# EAGLE design Placa frizzy (EAGLE 7.7.0)

## Sheet 1 of 4
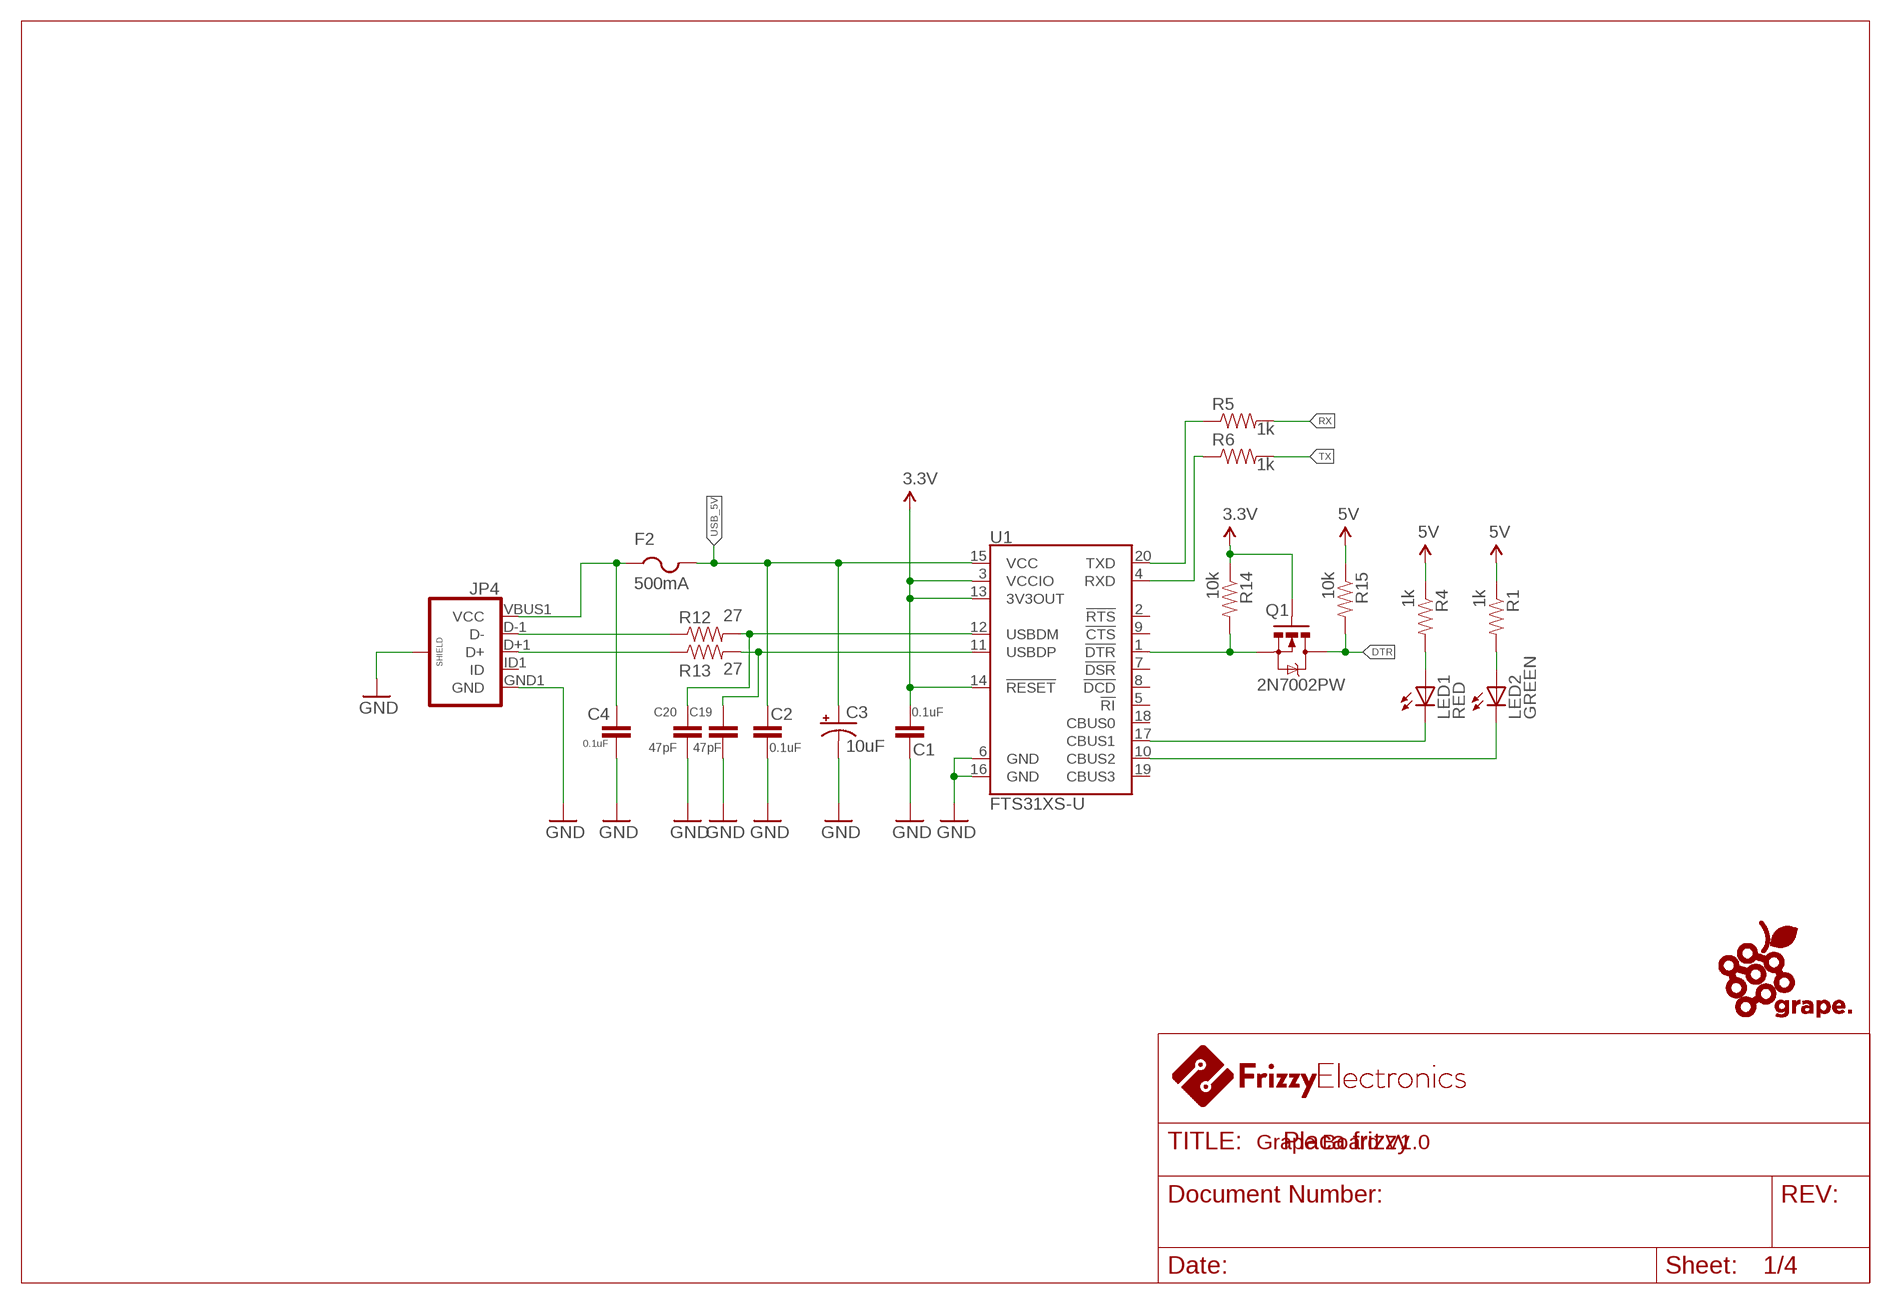
[diagram p0: schematic, sheet 1]

### Parts
C1  0.1uF  CAP0805  [0805]
C2  0.1uF  CAP0805  [0805]
C3  10uF  10UF-16V-10%(TANT)  [EIA3216]
C4  0.1uF  CAP0805  [0805]
C19  47pF  CAP0805  [0805]
C20  47pF  CAP0805  [0805]
F2  500mA  PTCFUSE-1812  [1812]
JP4  USB_MICROB_PLUGCONN-11752  [USB-B-MICRO-SMD_V03]
LED1  RED  LEDCHIP-LED0805  [CHIP-LED0805]
LED2  GREEN  LEDCHIP-LED0805  [CHIP-LED0805]
Q1  2N7002PW  MOSFET-NCHANNEL2N7002PW  [SOT323]
R1  1k  RESISTOR0805-RES  [0805]
R4  1k  RESISTOR0805-RES  [0805]
R5  1k  RESISTOR0805-RES  [0805]
R6  1k  RESISTOR0805-RES  [0805]
R12  27  RESISTOR0805-RES  [0805]
R13  27  RESISTOR0805-RES  [0805]
R14  10k  RESISTOR0805-RES  [0805]
R15  10k  RESISTOR0805-RES  [0805]
U1  FTS31XS-U  FT231XS  [SSOP20_L]

### Nets
3.3V: C1.2 Q1.1(G) R14.1 U1.3(VCCIO) U1.13(3V3OUT) U1.14(!RESET) ; also sheet 2,3
5V: R1.1 R4.1 R15.1 ; also sheet 2,3,4
DTR: Q1.3(D) R15.2 ; also sheet 2
GND: C1.1 C2.1 C3.C(-) C4.2 C19.1 C20.1 JP4.GND1(GND) JP4.SHIELD1(SHIELD) JP4.SHIELD2(SHIELD) JP4.SHIELD3(SHIELD) U1.6(GND) U1.16(GND) ; also sheet 2,3,4
N$2: LED1.C U1.17(CBUS1)
N$4: LED2.C U1.10(CBUS2)
N$5: LED1.A R4.2
N$6: LED2.A R1.2
N$8: R5.1 U1.20(TXD)
N$9: R6.1 U1.4(RXD)
N$13: C20.2 R12.2 U1.12(USBDM)
N$14: Q1.2(S) R14.2 U1.1(!DTR)
N$15: C19.2 R13.2 U1.11(USBDP)
N$24: JP4.D-1(D-) R12.1
N$28: JP4.D+1(D+) R13.1
N$29: C4.1 F2.1 JP4.VBUS1(VCC)
RX: R5.2 ; also sheet 2,4
TX: R6.2 ; also sheet 2,4
USB_5V: C2.2 C3.A(+) F2.2 U1.15(VCC) ; also sheet 3
Unconnected: JP4.ID1(ID) U1.2(!RTS) U1.5(!RI) U1.7(!DSR) U1.8(!DCD) U1.9(!CTS) U1.18(CBUS0) U1.19(CBUS3)

### Notes on the sheet
- Grape Board V1.0

## Sheet 2 of 4
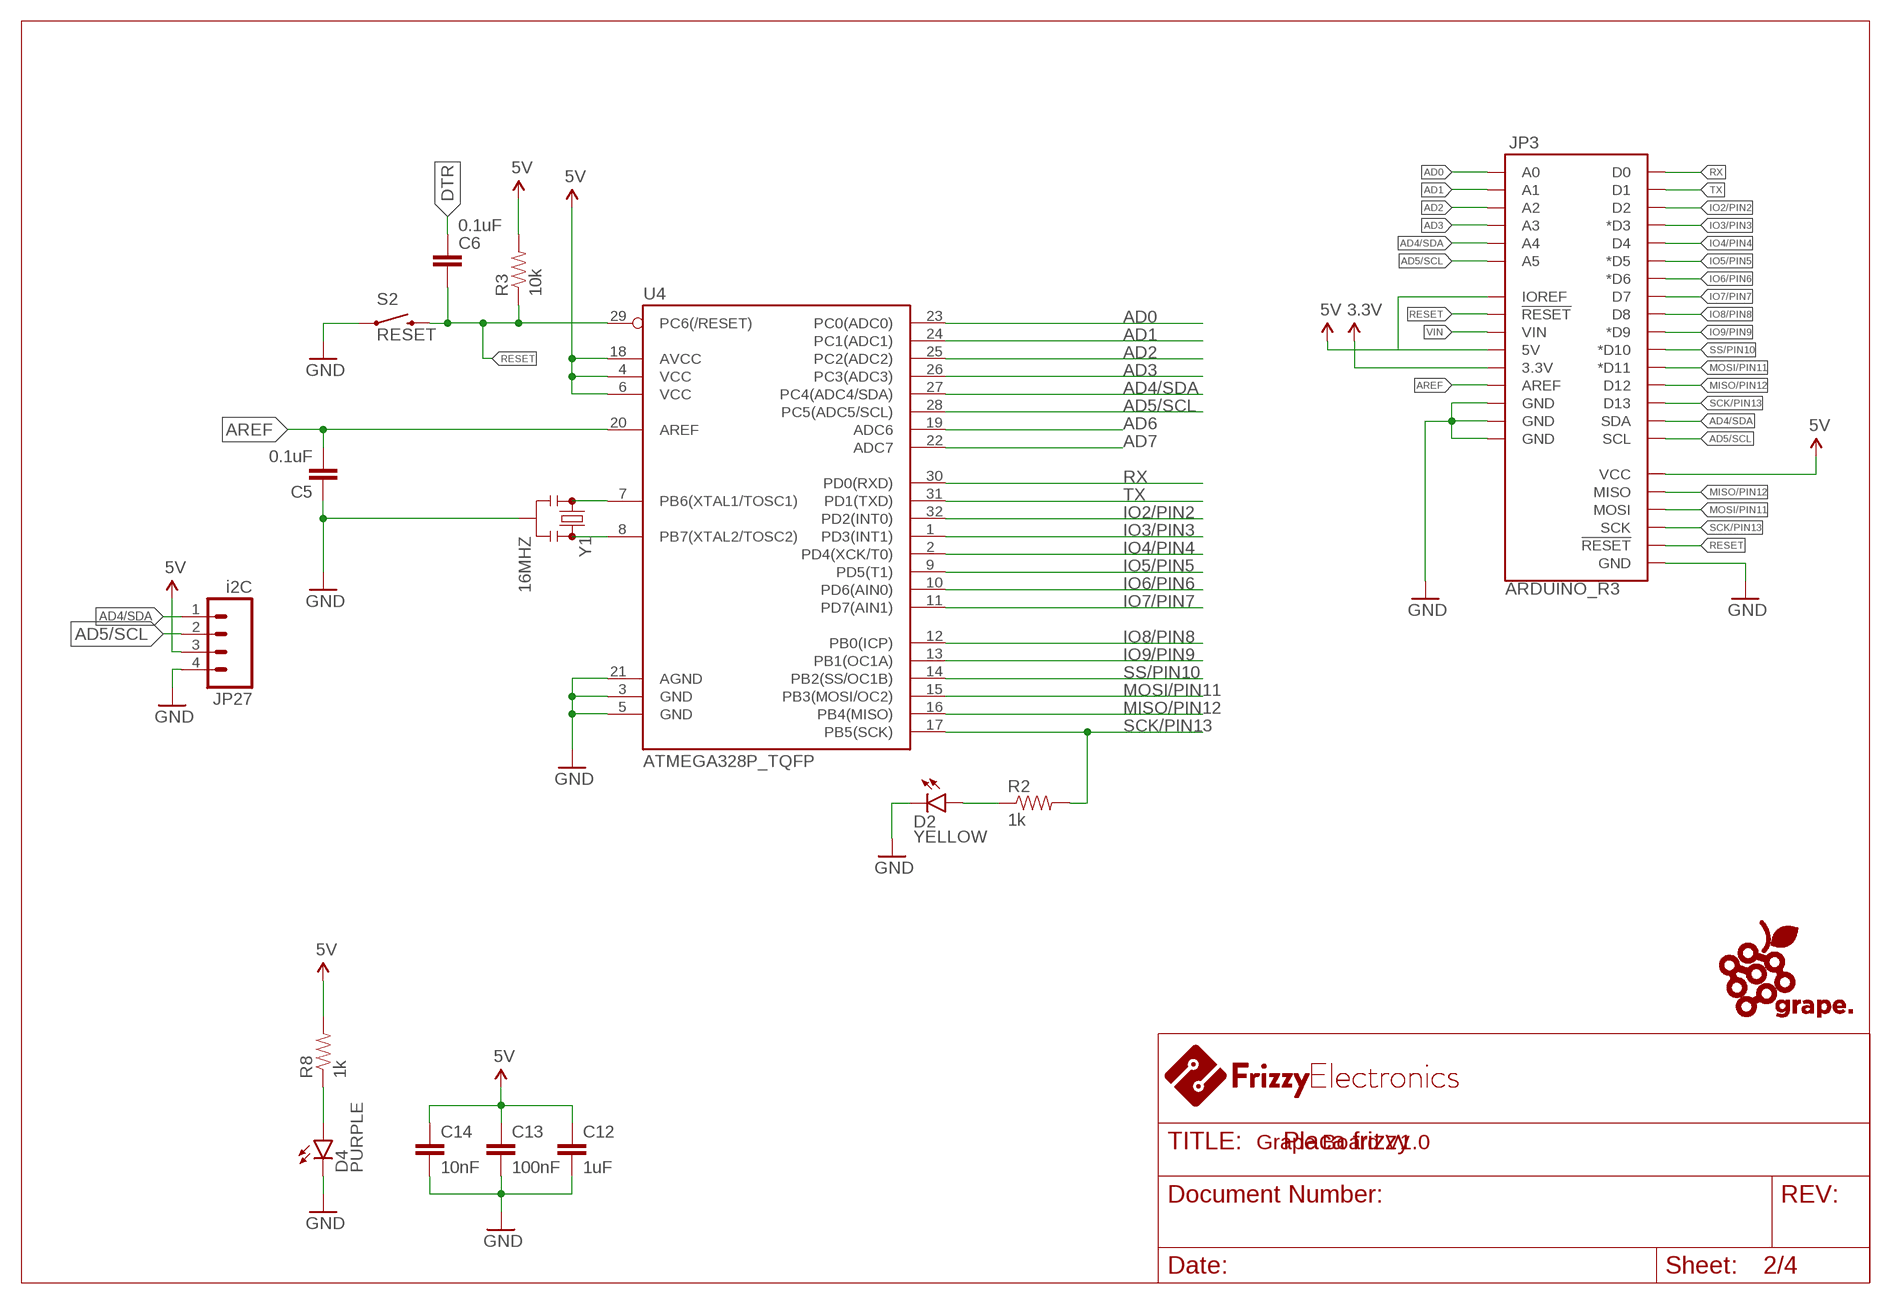
[diagram p1: schematic, sheet 2]

### Parts
C5  0.1uF  CAP0603-CAP  [0603-CAP]
C6  0.1uF  CAP0603-CAP  [0603-CAP]
C12  1uF  CAP0603-CAP  [0603-CAP]
C13  100nF  CAP0603-CAP  [0603-CAP]
C14  10nF  CAP0603-CAP  [0603-CAP]
D2  YELLOW  LED-BLUE0603  [LED-0603]
D4  PURPLE  LED0603  [LED-0603]
JP3  ARDUINO_R3  [ARDUINO_R3]
JP27  i2C  M04JST-PTH  [JST-4-PTH]
R2  1k  RESISTOR0805-RES  [0805]
R3  10k  RESISTOR0805-RES  [0805]
R8  1k  RESISTOR0805-RES  [0805]
S2  RESET  SWITCH-MOMENTARY-2SIDE_EZ  [TACTILE-PTH-SIDEEZ]
U4  ATMEGA328P_TQFP  [TQFP32-08]
Y1  16MHZ  RESONATOR16MHZ  [RESONATOR-SMD]

### Nets
3.3V: JP3.3.3V ; also sheet 1,3
5V: C12.1 C13.1 C14.1 JP3.5V JP3.IOREF JP3.VCC JP27.3 R3.2 R8.2 U4.4(VCC) U4.6(VCC) U4.18(AVCC) ; also sheet 1,3,4
AD0: JP3.A0 U4.23(PC0(ADC0)) ; also sheet 4
AD1: JP3.A1 U4.24(PC1(ADC1)) ; also sheet 4
AD2: JP3.A2 U4.25(PC2(ADC2)) ; also sheet 4
AD3: JP3.A3 U4.26(PC3(ADC3)) ; also sheet 4
AD4/SDA: JP3.A4 JP3.SDA JP27.1 U4.27(PC4(ADC4/SDA)) ; also sheet 4
AD5/SCL: JP3.A5 JP3.SCL JP27.2 U4.28(PC5(ADC5/SCL)) ; also sheet 4
AD6: U4.19(ADC6) ; also sheet 4
AD7: U4.22(ADC7) ; also sheet 4
AREF: C5.2 JP3.AREF U4.20(AREF)
DTR: C6.1 ; also sheet 1
GND: C5.1 C12.2 C13.2 C14.2 D2.C D4.C JP3.GND@1(GND) JP3.GND@2(GND) JP3.GND@3(GND) JP3.GND@4(GND) JP27.4 S2.1 U4.3(GND) U4.5(GND) U4.21(AGND) Y1.2 ; also sheet 1,3,4
IO2/PIN2: JP3.D2 U4.32(PD2(INT0)) ; also sheet 4
IO3/PIN3: JP3.D3(*D3) U4.1(PD3(INT1)) ; also sheet 4
IO4/PIN4: JP3.D4 U4.2(PD4(XCK/T0)) ; also sheet 4
IO5/PIN5: JP3.D5(*D5) U4.9(PD5(T1)) ; also sheet 4
IO6/PIN6: JP3.D6(*D6) U4.10(PD6(AIN0)) ; also sheet 4
IO7/PIN7: JP3.D7 U4.11(PD7(AIN1)) ; also sheet 4
IO8/PIN8: JP3.D8 U4.12(PB0(ICP)) ; also sheet 4
IO9/PIN9: JP3.D9(*D9) U4.13(PB1(OC1A)) ; also sheet 4
MISO/PIN12: JP3.D12 JP3.MISO U4.16(PB4(MISO)) ; also sheet 4
MOSI/PIN11: JP3.D11(*D11) JP3.MOSI U4.15(PB3(MOSI/OC2)) ; also sheet 4
N$1: D2.A R2.1
N$3: D4.A R8.1
N$7: U4.7(PB6(XTAL1/TOSC1)) Y1.1
N$12: U4.8(PB7(XTAL2/TOSC2)) Y1.3
RESET: C6.2 JP3.RESET@1(!RESET!) JP3.RESET@2(!RESET!) R3.1 S2.2 U4.29(PC6(/RESET))
RX: JP3.D0 U4.30(PD0(RXD)) ; also sheet 1,4
SCK/PIN13: JP3.D13 JP3.SCK R2.2 U4.17(PB5(SCK)) ; also sheet 4
SS/PIN10: JP3.D10(*D10) U4.14(PB2(SS/OC1B)) ; also sheet 4
TX: JP3.D1 U4.31(PD1(TXD)) ; also sheet 1,4
VIN: JP3.VIN ; also sheet 3

### Notes on the sheet
- Grape Board V1.0

## Sheet 3 of 4
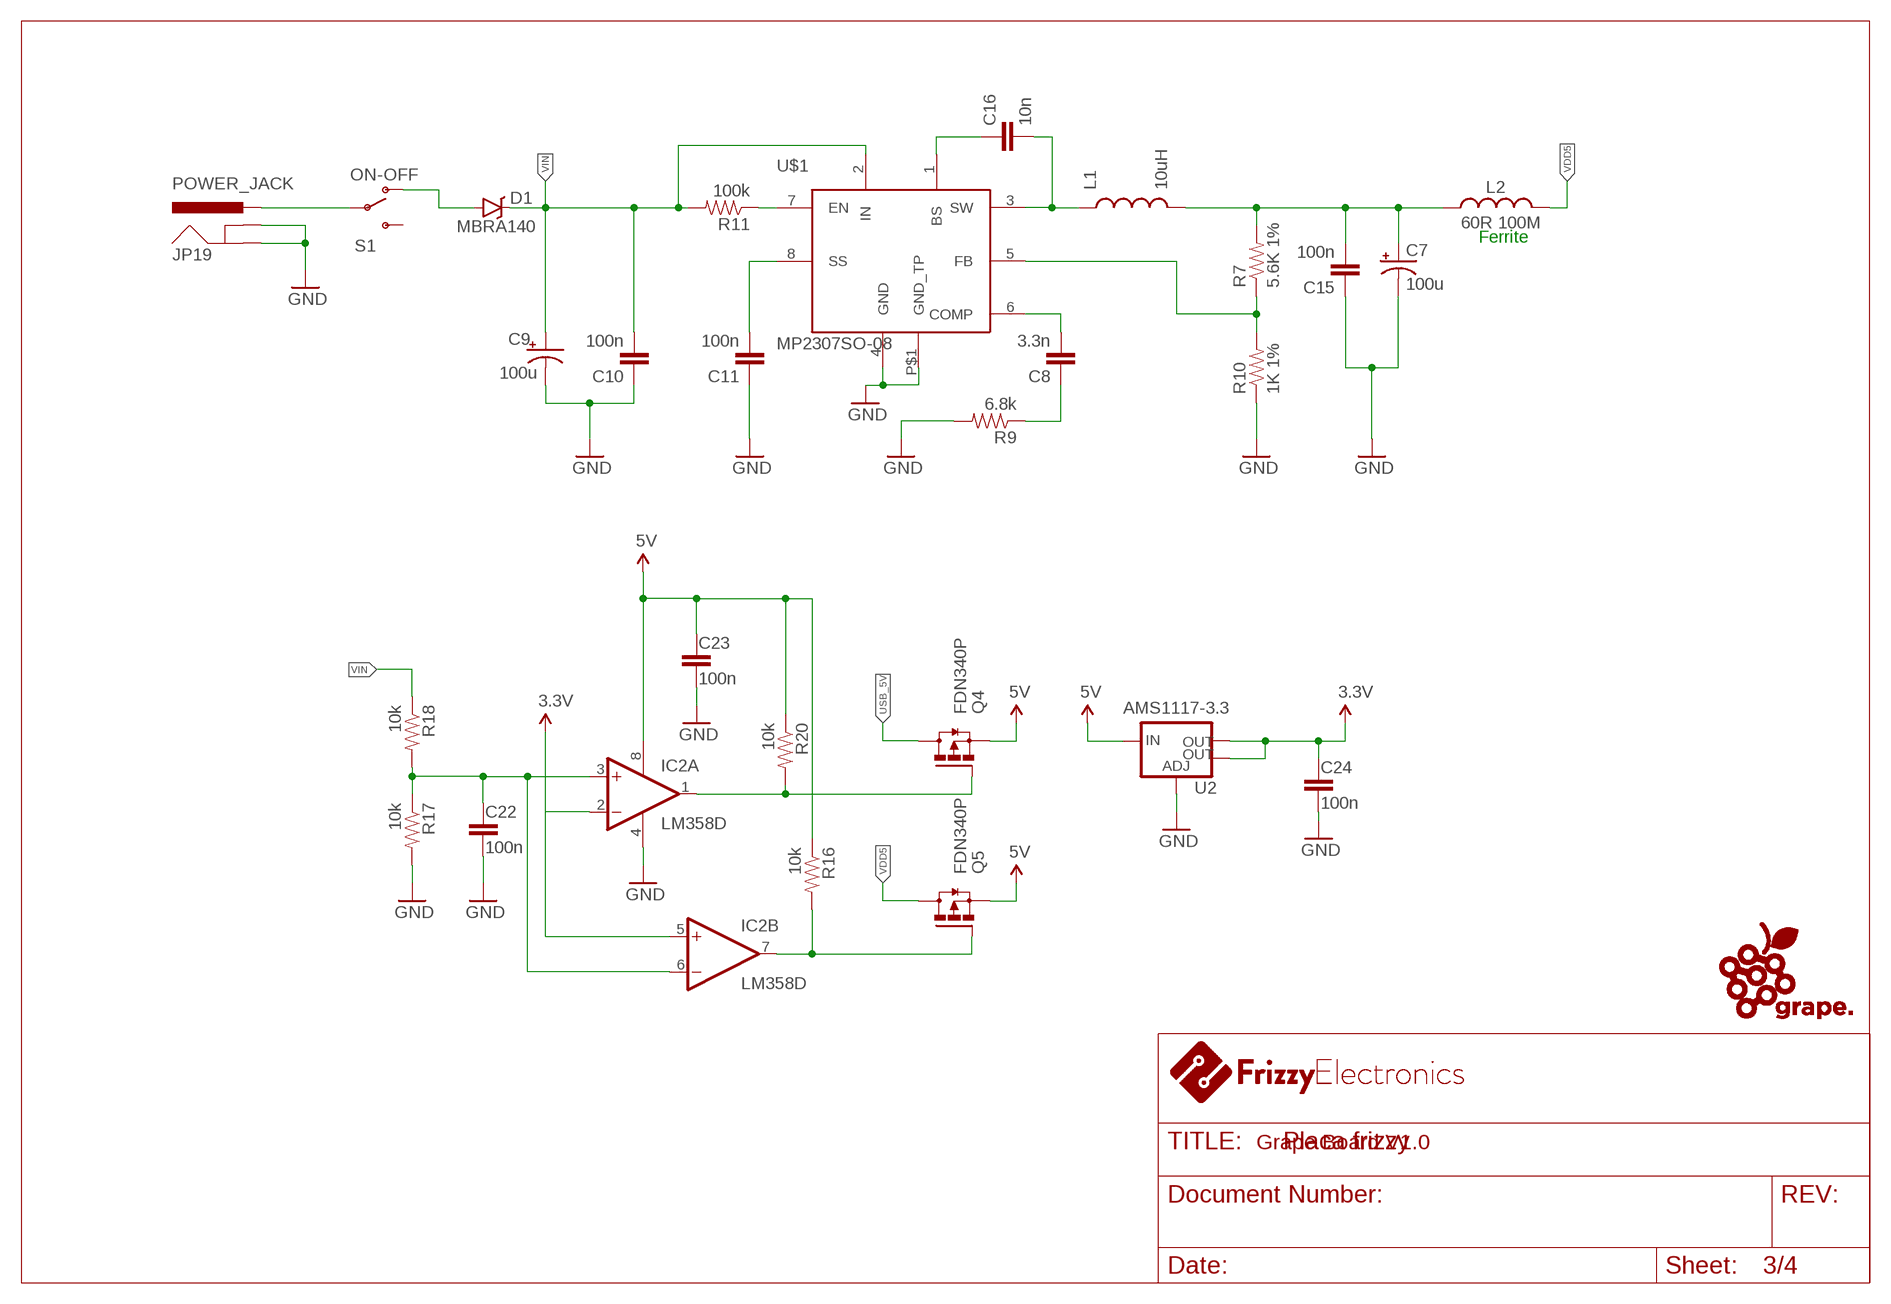
[diagram p2: schematic, sheet 3]

### Parts
C7  100u  47UF-50V-20%(ELECT)  [PANASONIC_D]
C8  3.3n  CAP0805  [0805]
C9  100u  47UF-50V-20%(ELECT)  [PANASONIC_D]
C10  100n  CAP0805  [0805]
C11  100n  CAP0805  [0805]
C15  100n  CAP0805  [0805]
C16  10n  CAP0805  [0805]
C22  100n  CAP0805  [0805]
C23  100n  CAP0805  [0805]
C24  100n  CAP0805  [0805]
D1  MBRA140  [SMA-DIODE]
IC2  LM358D  [SO08]
JP19  POWER_JACK  POWER_JACKPTH  [POWER_JACK_PTH]
L1  10uH  INDUCTORNPI75  [NPI75C]
L2  60R 100M  INDUCTOR0805  [0805]
Q4  FDN340P  FDN360P  [SUPER-SOT3]
Q5  FDN340P  FDN360P  [SUPER-SOT3]
R7  5.6K 1%  RESISTOR0805-RES  [0805]
R9  6.8k  RESISTOR0805-RES  [0805]
R10  1K 1%  RESISTOR0805-RES  [0805]
R11  100k  RESISTOR0805-RES  [0805]
R16  10k  RESISTOR0805-RES  [0805]
R17  10k  RESISTOR0805-RES  [0805]
R18  10k  RESISTOR0805-RES  [0805]
R20  10k  RESISTOR0805-RES  [0805]
S1  ON-OFF  SWITCH-SPDT-SMD-A  [SWITCH-SPST-SMD-A]
U2  AMS1117-3.3  V_REG_LM1117SOT223  [SOT223]
U$1  MP2307SO-08  [SO-08]

### Nets
3.3V: C24.1 IC2.2(A:-IN) IC2.5(B:+IN) U2.2(OUT) U2.4(OUT) ; also sheet 1,2
5V: C23.1 IC2.8(P:V+) Q4.2(S) Q5.2(S) R16.1 R20.1 U2.3(IN) ; also sheet 1,2,4
GND: C7.- C9.- C10.1 C11.1 C15.1 C22.2 C23.2 C24.2 IC2.4(P:V-) JP19.GND JP19.GNDBREAK R9.2 R10.1 R17.2 U2.1(ADJ) U$1.4(GND) U$1.P$1(GND_TP) ; also sheet 1,2,4
N$10: C8.1 R9.1
N$11: C8.2 U$1.6(COMP)
N$16: R7.1 R10.2 U$1.5(FB)
N$17: C16.1 U$1.1(BS)
N$18: C16.2 L1.1 U$1.3(SW)
N$19: C7.+ C15.2 L1.2 L2.1 R7.2
N$20: C11.2 U$1.8(SS)
N$21: R11.1 U$1.7(EN)
N$22: JP19.PWR S1.2(P)
N$23: D1.A S1.1(O)
N$25: C22.1 IC2.3(A:+IN) IC2.6(B:-IN) R17.1 R18.2
N$26: IC2.7(B:OUT) Q5.1(G) R16.2
N$27: IC2.1(A:OUT) Q4.1(G) R20.2
USB_5V: Q4.3(D) ; also sheet 1
VDD5: L2.2 Q5.3(D)
VIN: C9.+ C10.2 D1.C R11.2 R18.1 U$1.2(IN) ; also sheet 2
Unconnected: S1.3(S)

### Notes on the sheet
- Ferrite
- Grape Board V1.0

## Sheet 4 of 4
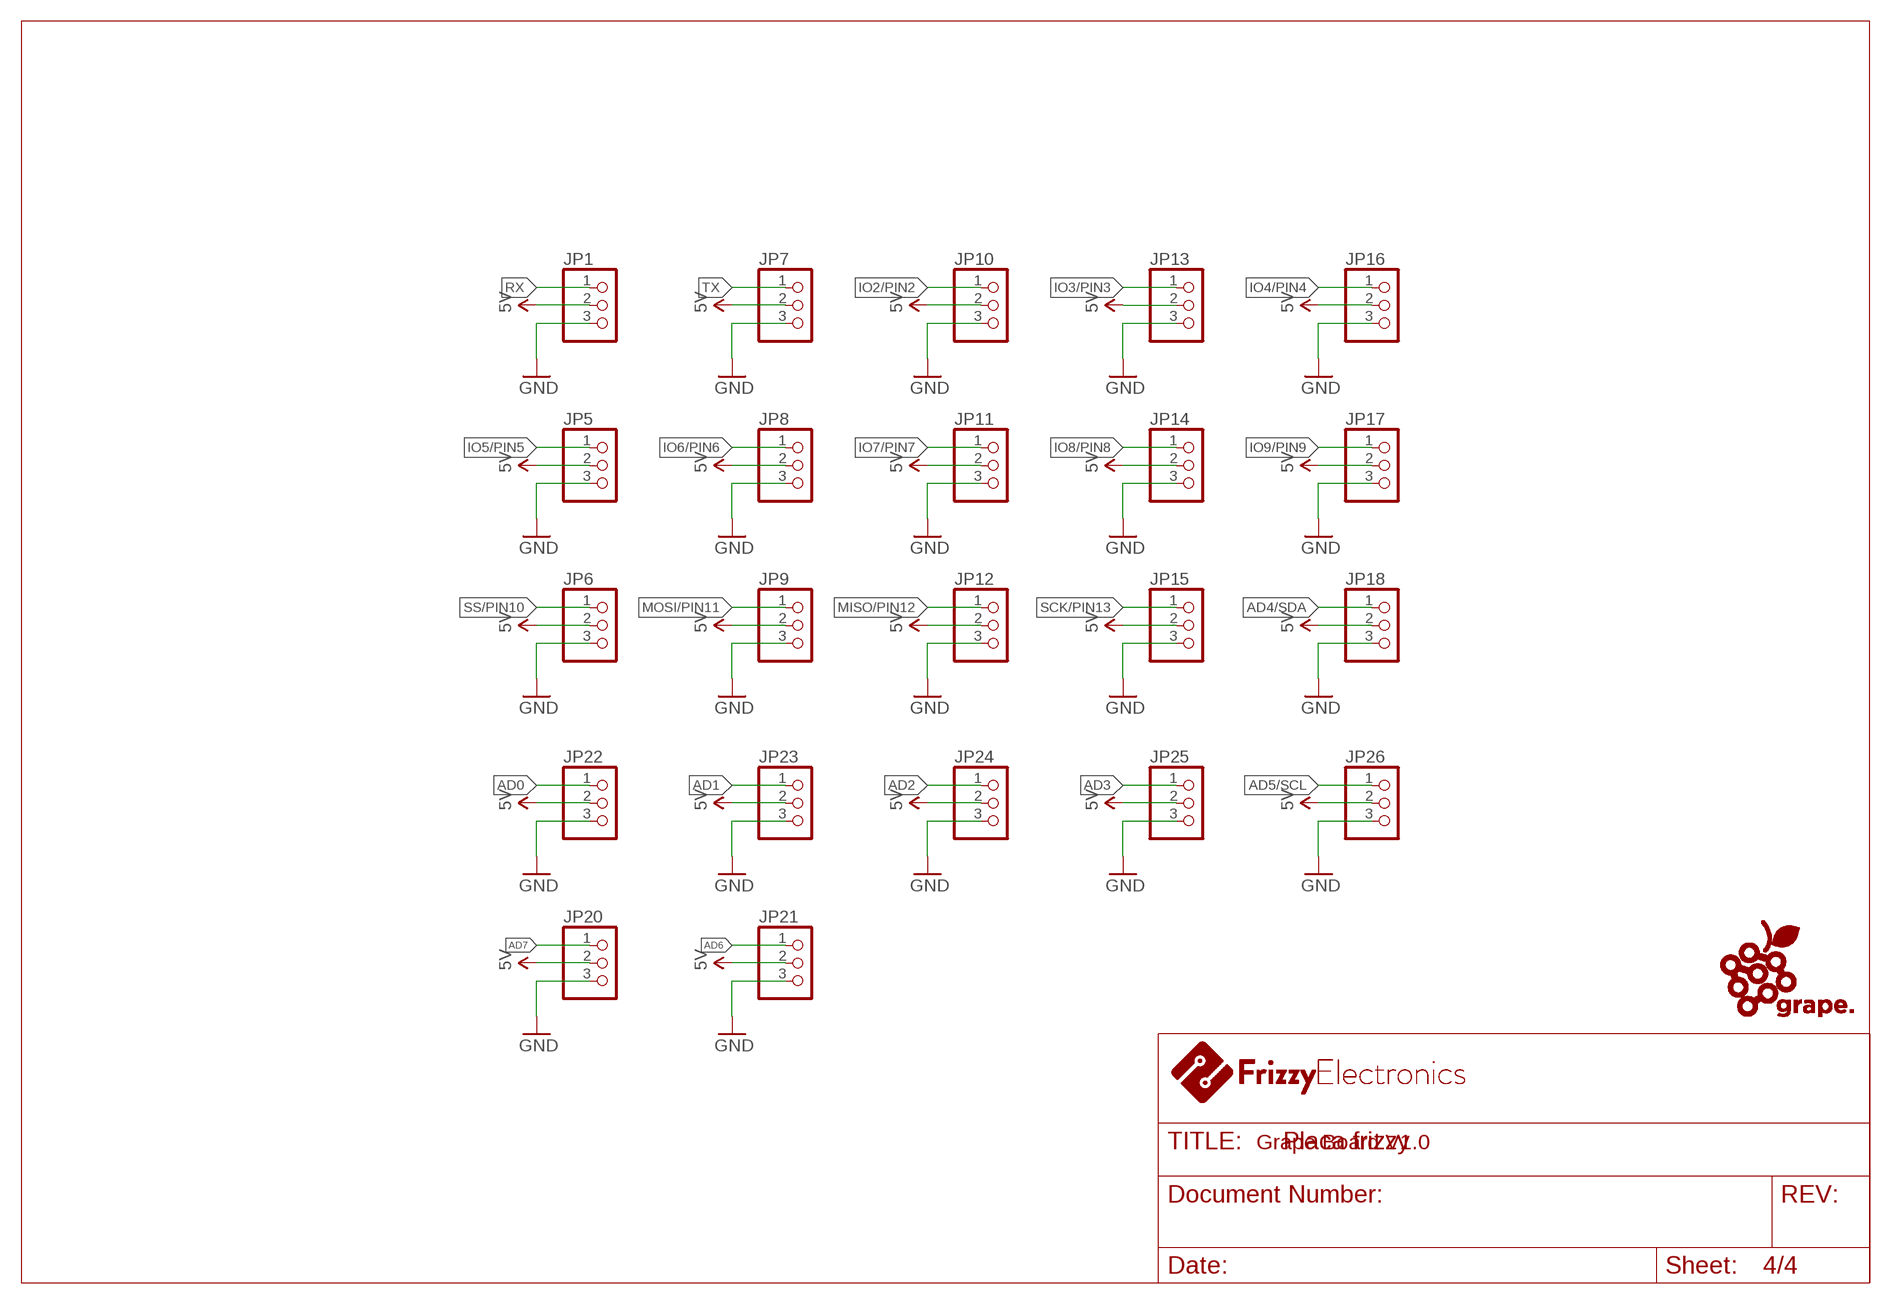
[diagram p3: schematic, sheet 4]

### Parts
JP1  PINHD-1X3  [1X03]
JP5  PINHD-1X3  [1X03]
JP6  PINHD-1X3  [1X03]
JP7  PINHD-1X3  [1X03]
JP8  PINHD-1X3  [1X03]
JP9  PINHD-1X3  [1X03]
JP10  PINHD-1X3  [1X03]
JP11  PINHD-1X3  [1X03]
JP12  PINHD-1X3  [1X03]
JP13  PINHD-1X3  [1X03]
JP14  PINHD-1X3  [1X03]
JP15  PINHD-1X3  [1X03]
JP16  PINHD-1X3  [1X03]
JP17  PINHD-1X3  [1X03]
JP18  PINHD-1X3  [1X03]
JP20  PINHD-1X3  [1X03]
JP21  PINHD-1X3  [1X03]
JP22  PINHD-1X3  [1X03]
JP23  PINHD-1X3  [1X03]
JP24  PINHD-1X3  [1X03]
JP25  PINHD-1X3  [1X03]
JP26  PINHD-1X3  [1X03]

### Nets
5V: JP1.2 JP5.2 JP6.2 JP7.2 JP8.2 JP9.2 JP10.2 JP11.2 JP12.2 JP13.2 JP14.2 JP15.2 JP16.2 JP17.2 JP18.2 JP20.2 JP21.2 JP22.2 JP23.2 JP24.2 JP25.2 JP26.2 ; also sheet 1,2,3
AD0: JP22.1 ; also sheet 2
AD1: JP23.1 ; also sheet 2
AD2: JP24.1 ; also sheet 2
AD3: JP25.1 ; also sheet 2
AD4/SDA: JP18.1 ; also sheet 2
AD5/SCL: JP26.1 ; also sheet 2
AD6: JP21.1 ; also sheet 2
AD7: JP20.1 ; also sheet 2
GND: JP1.3 JP5.3 JP6.3 JP7.3 JP8.3 JP9.3 JP10.3 JP11.3 JP12.3 JP13.3 JP14.3 JP15.3 JP16.3 JP17.3 JP18.3 JP20.3 JP21.3 JP22.3 JP23.3 JP24.3 JP25.3 JP26.3 ; also sheet 1,2,3
IO2/PIN2: JP10.1 ; also sheet 2
IO3/PIN3: JP13.1 ; also sheet 2
IO4/PIN4: JP16.1 ; also sheet 2
IO5/PIN5: JP5.1 ; also sheet 2
IO6/PIN6: JP8.1 ; also sheet 2
IO7/PIN7: JP11.1 ; also sheet 2
IO8/PIN8: JP14.1 ; also sheet 2
IO9/PIN9: JP17.1 ; also sheet 2
MISO/PIN12: JP12.1 ; also sheet 2
MOSI/PIN11: JP9.1 ; also sheet 2
RX: JP1.1 ; also sheet 1,2
SCK/PIN13: JP15.1 ; also sheet 2
SS/PIN10: JP6.1 ; also sheet 2
TX: JP7.1 ; also sheet 1,2

### Notes on the sheet
- Grape Board V1.0

## Library data of the parts
C1 C2 C4 C8 C10 C11 C15 C16 C19 C20 C22-C24 = SparkFun-Passives:CAP: Capacitor Standard 0603 ceramic capacitor, and 0.1" leaded capacitor.
C3 = SparkFun-Capacitors:10UF-16V-10%(TANT): CAP-00811 1206/EIA-3216 Tantalum capacitor; PROD_ID: CAP-00811
C5 C6 C12-C14 = SparkFun-Capacitors:CAP: Capacitor Standard 0603 ceramic capacitor, and 0.1" leaded capacitor.
C7 C9 = SparkFun-Capacitors:47UF-50V-20%(ELECT): CAP-10547; PROD_ID: CAP-10547
D1 = SparkFun-DiscreteSemi:MBRA140: 40V, 1A Schottky rectifier SMA/DO-214AC package DIO-08053; PROD_ID: DIO-08053
D2 = SparkFun-LED:LED-BLUE: Blue LEDs for production use Various blue LEDs stocked by SparkFun production 0603 - DIO-08575 Rebel - DIO-09553 1206 - DIO-09911; PROD_ID: DIO-08575; VALUE: BLUE
D4 = SparkFun-LED:LED: LEDs Standard schematic elements and footprints for 5mm, 3mm, 1206, and 0603 sized LEDs. 5mm - Spark Fun Electronics SKU : COM-00529 (and others)
F2 = adafruit:PTCFUSE: PTC fuses, resettable thermistors
IC2 = linear:LM358: OP AMP also LM158; LM258; LM2904 Source: http://cache.national.com/ds/LM/LM158.pdf
JP1 JP5-JP18 JP20-JP26 = adafruit:PINHD-1X3: PIN HEADER
JP3 = SparkFun-Boards:ARDUINO_R3: Arduino R3 Footprint (w/ SPI header)
JP4 = SparkFun-Connectors:USB_MICROB_PLUG: USB Micro-B connectors Some male, some female. Watch your step!; PROD_ID: CONN-11752
JP19 = SparkFun-Connectors:POWER_JACK: Power Jack This is the standard 5.5mm barrel jack for power. The PTH is the most common, proven, reliable, footprint. The Slot footprint only works if the mill layer is transmitted to the PCB fab house so be warned. Mating wall wart : TOL-00298 (and others); PROD_ID: CONN-08197
JP27 = SparkFun-Connectors:M04: Header 4 Standard 4-pin 0.1" header. Use with straight break away headers (SKU : PRT-00116), right angle break away headers (PRT-00553), swiss pins (PRT-00743), machine pins (PRT-00117), and female headers (PRT-00115). Molex polarized connector foot print use with SKU : PRT-08231 with associated crimp pins and housings. 1MM SMD Version SKU: PRT-10208; SKU: PRT-09916
L1 L2 = SparkFun-Passives:INDUCTOR: Inductors Basic Inductor/Choke - 0603 and 1206. Footprints are not proven and vary greatly between part numbers. INDUCTOR POWER 3.3UH 4.0A SMD 0.197" L x 0.197" W x 0.177" H (5.00mm x 5.00mm x 4.50mm)
LED1 LED2 = adafruit:LED: LED OSRAM: - CHIPLED LG R971, LG N971, LY N971, LG Q971, LY Q971, LO R971, LY R971 LH N974, LH R974 LS Q976, LO Q976, LY Q976 LO Q996 - Hyper CHIPLED LW Q18S LB Q993, LB Q99A, LB R99A - SideLED LS A670, LO A670, LY A670, LG A670, LP A670 LB A673, LV A673, LT A673, LW A673 LH A674 LY A675 LS A676, LA A676, LO A676, LY A676, LW A676 LS A679, LY A679, LG A679 - Hyper Micro SIDELED® LS Y876, LA Y876, LO Y876, LY Y876 LT Y87S - SmartLED LW L88C, LW L88S LB L89C, LB L89S, LG L890 LS L89K, LO L89K, LY L89K LS L896, LA L896, LO L896, LY L896 - TOPLED LS T670, LO T670, LY T670, LG T670, LP T670 LSG T670, LSP T670, LSY T670, LOP T670, LYG T670 LG T671, LOG T671, LSG T671 LB T673, LV T673, LT T673, LW T673 LH T674 LS T676, LA T676, LO T676, LY T676, LB T676, LH T676, LSB T676, LW T676 LB T67C, LV T67C, LT T67C, LS T67K, LO T67K, LY T67K, LW E67C LS E67B, LA E67B, LO E67B, LY E67B, LB E67C, LV E67C, LT E67C LW T67C LS T679, LY T679, LG T679 LS T770, LO T770, LY T770, LG T770, LP T770 LB T773, LV T773, LT T773, LW T773 LH T774 LS E675, LA E675, LY E675, LS T675 LS T776, LA T776, LO T776, LY T776, LB T776 LHGB T686 LT T68C, LB T68C - Hyper Mini TOPLED® LB M676 - Mini TOPLED Santana® LG M470 LS M47K, LO M47K, LY M47K Source: http://www.osram.convergy.de/
Q1 = SparkFun-DiscreteSemi:MOSFET-NCHANNEL: Common NMOSFET Parts MFG P/N Store ID Prod ID FDD8780 TRANS-09984 SI7820DN TRANS-11055 FDS6630A IC-08089 2N7002PW TRANS-11151 FQP30N06L COM-10213 TRANS-10060 BSS123LT1G TRANS-08345 BSS138 TRANS-00830 BS170 2N7000; PROD_ID: TRANS-11151
Q4 Q5 = transistor-power:FDN360P: Single P-Channel, PowerTrench (R) MOSFET Source: http://www.fairchildsemi.com/ds/FD/FDN360P.pdf
R1-R18 R20 = SparkFun-Passives:RESISTOR: Resistor Basic schematic elements and footprints for 0603, 1206, and PTH resistors.
S1 = SparkFun-Electromechanical:SWITCH-SPDT: SPDT Switch Simple slide switch, Spark Fun Electronics SKU : COM-00102 DPDT SMT slide switch, AYZ0202, SWCH-08179
S2 = SparkFun-Electromechanical:SWITCH-MOMENTARY-2: Various NO switches- pushbuttons, reed, etc
U1 = SparkFun-DigitalIC:FT231X: FTDI FT231X Full Speed USB to Full-handshake UART This USB2.0 Full Speed IC offers a compact bridge to full handshake UART interfaces. The device is a UART, capable of operating up to 3MBaud, with low power consumption (8mA). The FT231X includes the complete FT-X series feature set and enables USB to be added into a system design quickly and easily over a UART interface.; PROD_ID: IC-11524
U2 = SparkFun-PowerIC:V_REG_LM1117: Voltage Regulator LM1117 Standard adjustable voltage regulator but in SMD form. Spark Fun Electronics SKU : COM-00595; PROD_ID: VREG-08170
U4 = SparkFun-DigitalIC:ATMEGA328P_TQFP; PROD_ID: IC-09069
U$1 = MP2307:MP2307: The MP2307 is a monolithic synchronous buck regulator. The device integrates 100mΩ MOSFETS that provide 3A of continuous load current over a wide operating input voltage of 4.75V to 23V. Current mode control provides fast transient response and cycle-by-cycle current limit.
Y1 = SparkFun-FreqCtrl:RESONATOR: Resonator Small SMD resonator. Used, eg, on the Arduino Pro/ Pro Mini boards. 8MHz- XTAL-08895 16MHz- XTAL-08900; PROD_ID: XTAL-08900

## Board
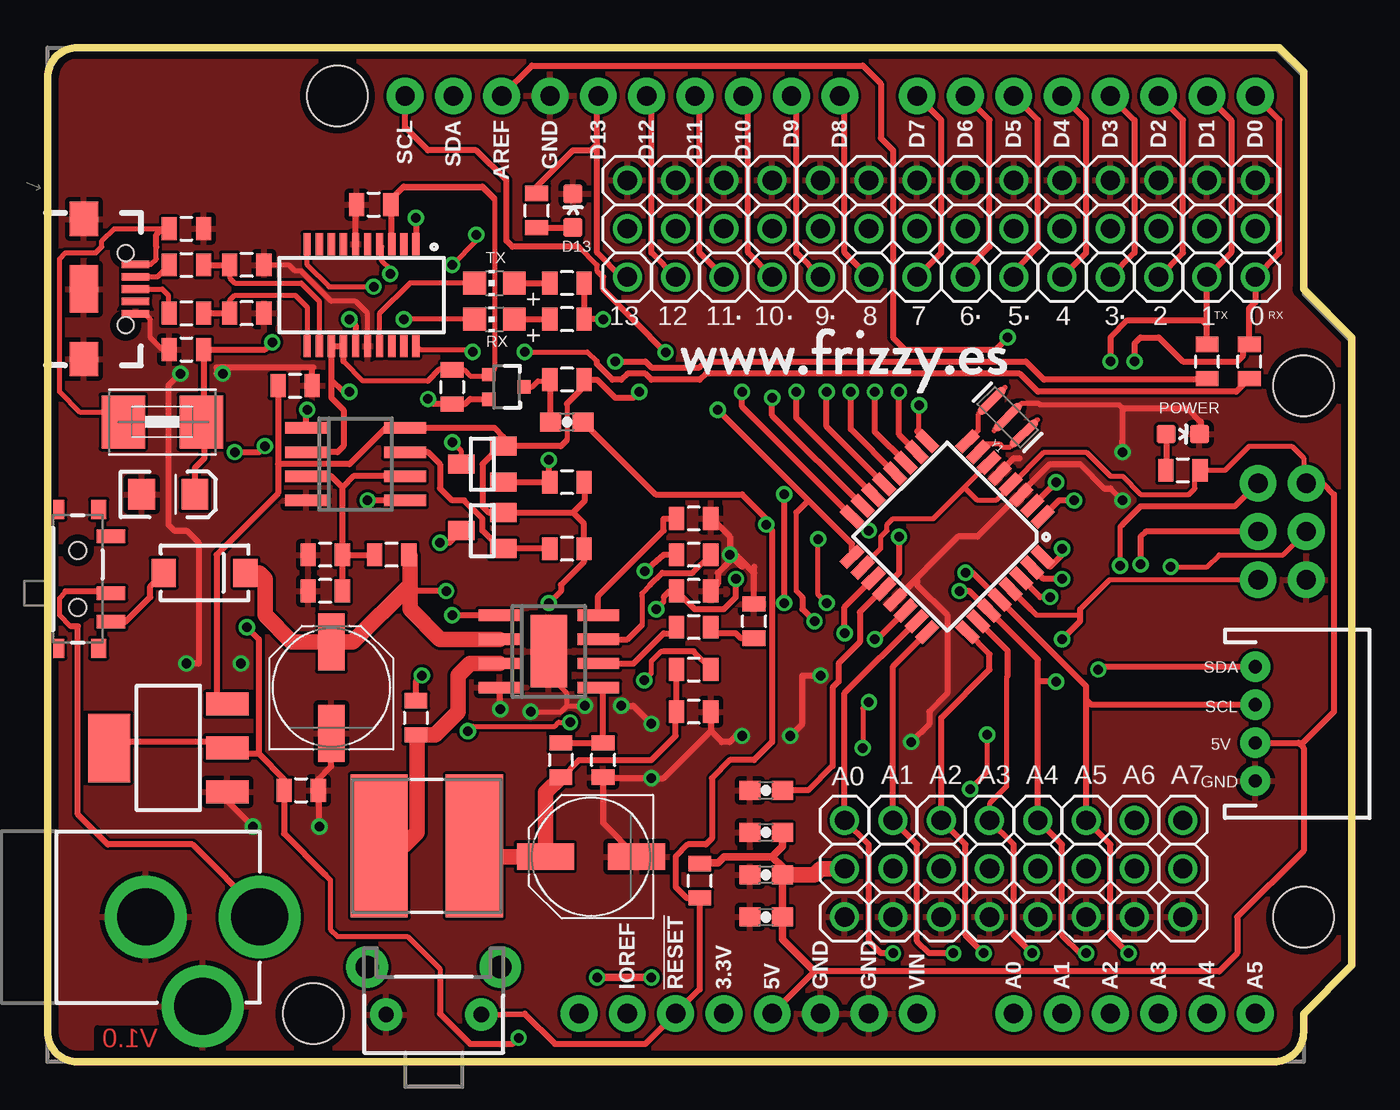
[diagram p4: board, top side]
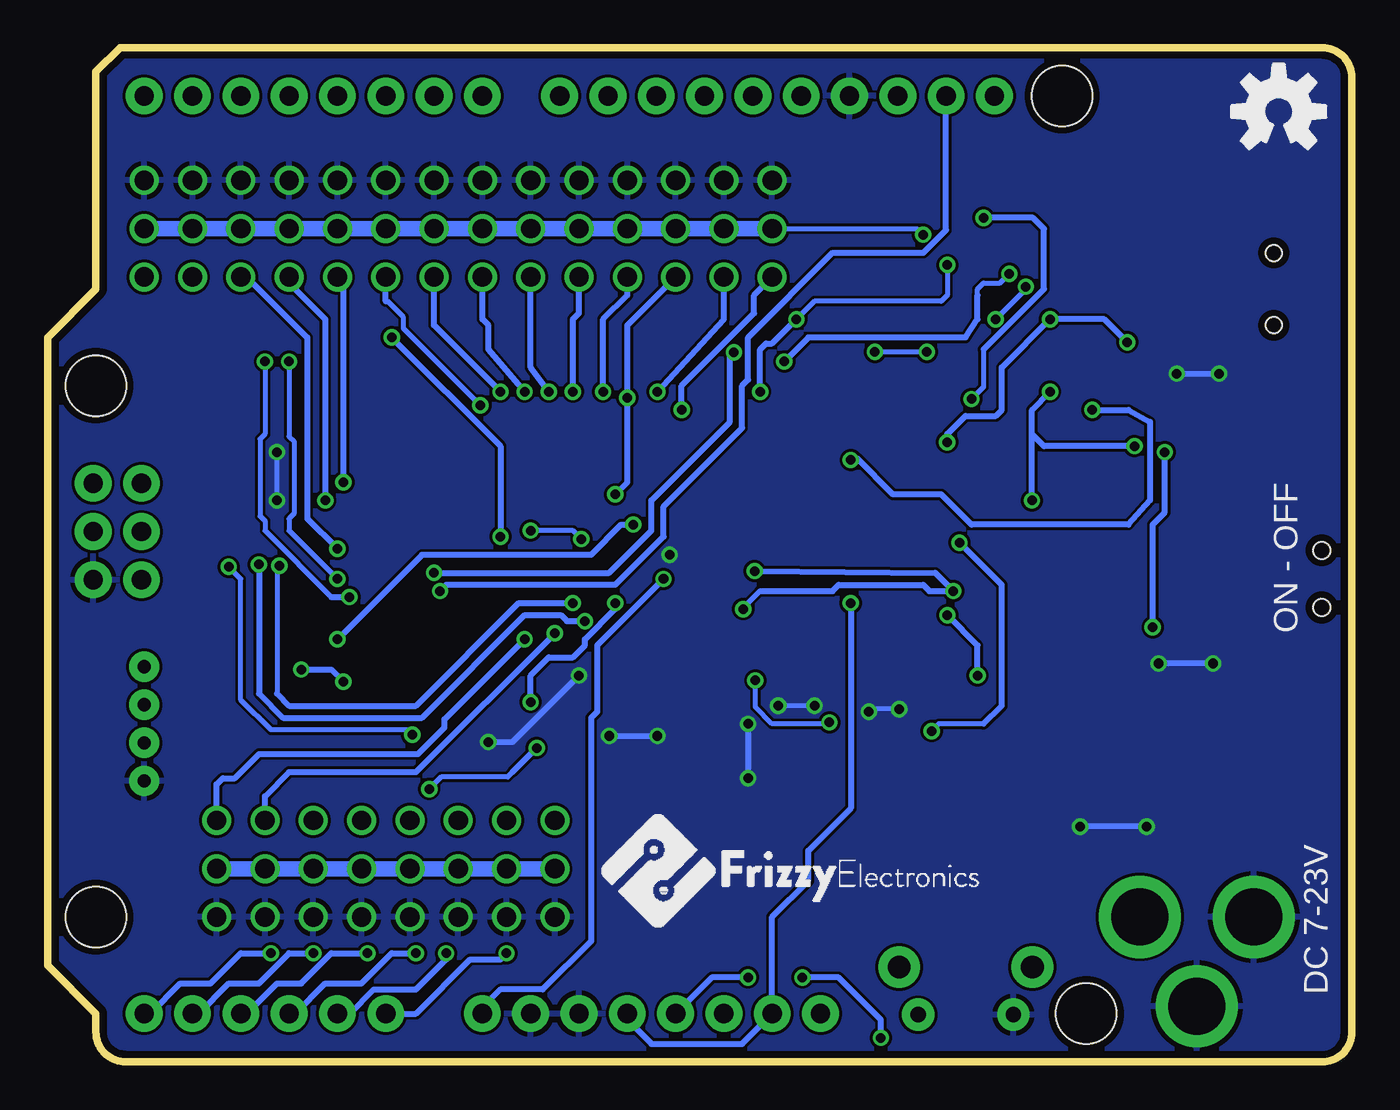
[diagram p5: board, bottom side, seen from below]

Size 68.58 x 53.34 mm. Coordinates in mm from the lower left corner, seen from the top.
Outline: 1.59,53.34 64.77,53.34 66.04,52.07 66.04,40.64 68.58,38.1 68.58,5.08 66.04,2.54 66.04,1.59 arc-90 64.45,0 1.59,0 arc-90 0,1.59 0,51.75 arc-90 1.59,53.34
Copper layers (1*16): Top 0.0356mm / dielectric 1.5011mm / Bottom 0.0356mm
Design rules "oshpark-2layer *": minimum track width 6mil, minimum drill 13mil, track to track 6mil, track to pad 6mil, pad to pad 6mil, via to via 6mil, smd to smd 6mil, copper to edge 15mil, drill to drill 6mil, minimum pad ring 7mil, minimum via ring 7mil, stop-mask expansion 4mil, vias tented up to drill 25mil, thermal gap 10mil

### Footprints (pad centres in the part's own frame; a part is rotated, then mirrored left to right if it is on the bottom)
0805 = smd 0.8 x 1.2: 1 -0.9,0; 2 0.9,0
EIA3216 = smd 1.4 x 1.6: A 1.4,0; C -1.4,0
0603-CAP = smd 1.1 x 1: 1 -0.85,0; 2 0.85,0
PANASONIC_D = smd 3 x 1.4: + 2.4,0; - -2.4,0
SMA-DIODE = smd 1.27 x 1.47: A -2.15,0; C 2.15,0
LED-0603 = smd 1 x 1: A 0,-0.877; C 0,0.877
1812 = smd 2.286 x 2.794: 1 -2.046,0; 2 2.046,0
SO08 = smd 0.6 x 2.2: 1 -1.905,-2.6; 2 -0.635,-2.6; 3 0.635,-2.6; 4 1.905,-2.6; 5 1.905,2.6; 6 0.635,2.6; 7 -0.635,2.6; 8 -1.905,2.6
1X03 = drill 1.016: 1 -2.54,0; 2 0,0; 3 2.54,0
ARDUINO_R3 = drill 1.016 pad 1.93: 3.3V 35.56,2.54; 5V 38.1,2.54; A0 50.8,2.54; A1 53.34,2.54; A2 55.88,2.54; A3 58.42,2.54; A4 60.96,2.54; A5 63.5,2.54; AREF 23.876,50.8; D0 63.5,50.8; D1 60.96,50.8; D2 58.42,50.8; D3 55.88,50.8; D4 53.34,50.8; D5 50.8,50.8; D6 48.26,50.8; D7 45.72,50.8; D8 41.656,50.8; D9 39.116,50.8; D10 36.576,50.8; D11 34.036,50.8; D12 31.496,50.8; D13 28.956,50.8; GND@1 40.64,2.54; GND@2 43.18,2.54; GND@3 26.416,50.8; GND@4 66.18,25.35; IOREF 30.48,2.54; MISO 63.64,30.43; MOSI 66.18,27.89; NC 27.94,2.54; RESET@1 33.02,2.54; RESET@2 63.64,25.35; SCK 63.64,27.89; SCL 18.796,50.8; SDA 21.336,50.8; VCC 66.18,30.43; VIN 45.72,2.54 | hole 3.175: 15.24,50.8; 66.04,35.56; 66.04,7.62; 13.97,2.54
USB-B-MICRO-SMD_V03 = smd 1.45 x 0.4: D+1 2.725,0; D-1 2.725,0.65; GND1 2.725,-1.3; ID1 2.725,-0.65; VBUS1 2.725,1.3 | smd 1.5 x 1.8: SHIELD1 0,3.685; SHIELD2 0,-3.685 | smd 1.5 x 2.5: SHIELD3 0,0 | hole 0.85: 2.2,1.9; 2.2,-1.9
POWER_JACK_PTH = drill 2.997 pad 4.318: GND 0,7.7; GNDBREAK 4.7,10.7; PWR 0,13.7
JST-4-PTH = drill 0.7 pad 1.6: 1 -3,0; 2 -1,0; 3 1,0; 4 3,0
NPI75C = smd 3 x 7.5: 1 -2.5,0; 2 2.5,0
CHIP-LED0805 = smd 1.2 x 1.2: A 0,-1.05; C 0,1.05
SOT323 = smd 0.7 x 0.7: 1 -0.65,-0.925; 2 0.65,-0.925; 3 0,0.925
SUPER-SOT3 = smd 1 x 1.4: 1 -0.95,-1.1; 2 0.95,-1.1; 3 0,1.1
SWITCH-SPST-SMD-A = smd 0.7 x 1.5: 1 -2.25,-1.75; 2 -0.75,-1.75; 3 2.25,-1.75 | smd 1 x 0.6: GND1 -3.65,1; GND3 3.65,1 | smd 1 x 0.8: GND2 -3.65,-1.1; GND4 3.65,-1.1 | hole 0.9: -1.5,0; 1.5,0
TACTILE-PTH-SIDEEZ = drill 0.8 pad 1.7: 1 -2.5,0; 2 2.5,0 | drill 1.2 pad 2.2: ANCHOR1 -3.5,2.5; ANCHOR2 3.5,2.5
SSOP20_L = smd 0.381 x 1.143: 1 -2.857,-2.68; 2 -2.223,-2.68; 3 -1.587,-2.68; 4 -0.953,-2.68; 5 -0.318,-2.68; 6 0.318,-2.68; 7 0.953,-2.68; 8 1.587,-2.68; 9 2.223,-2.68; 10 2.857,-2.68; 11 2.857,2.68; 12 2.223,2.68; 13 1.587,2.68; 14 0.953,2.68; 15 0.318,2.68; 16 -0.318,2.68; 17 -0.953,2.68; 18 -1.587,2.68; 19 -2.223,2.68; 20 -2.857,2.68
SOT223 = smd 1.219 x 2.235: 1 -2.311,-3.099; 2 0,-3.099; 3 2.311,-3.099 | smd 3.6 x 2.2: 4 0,3.099
TQFP32-08 = smd 1.27 x 0.559: 1 -4.293,2.8; 2 -4.293,2; 3 -4.293,1.2; 4 -4.293,0.4; 5 -4.293,-0.4; 6 -4.293,-1.2; 7 -4.293,-2; 8 -4.293,-2.8; 17 4.293,-2.8; 18 4.293,-2; 19 4.293,-1.2; 20 4.293,-0.4; 21 4.293,0.4; 22 4.293,1.2; 23 4.293,2; 24 4.293,2.8 | smd 0.559 x 1.27: 9 -2.8,-4.293; 10 -2,-4.293; 11 -1.2,-4.293; 12 -0.4,-4.293; 13 0.4,-4.293; 14 1.2,-4.293; 15 2,-4.293; 16 2.8,-4.293; 25 2.8,4.293; 26 2,4.293; 27 1.2,4.293; 28 0.4,4.293; 29 -0.4,4.293; 30 -1.2,4.293; 31 -2,4.293; 32 -2.8,4.293
SO-08 = smd 0.6 x 2.2: 1 -1.905,-2.6; 2 -0.635,-2.6; 3 0.635,-2.6; 4 1.905,-2.6; 5 1.905,2.6; 6 0.635,2.6; 7 -0.635,2.6; 8 -1.905,2.6 | smd 3.81 x 1.93: P$1 0,0
RESONATOR-SMD = smd 0.45 x 1.905: 1 -1.2,0; 2 0,0; 3 1.2,0

### Placement (x,y rotation side)
C1  17.15,45.08 0 top
C2  7.3,37.47 0 top
C3  6.35,29.85 0 top
C4  7.3,43.81 0 top
C5  37.78,14.29 0 top
C6  27.3,33.66 0 top
C7  28.57,10.79 180 top
C8  33.97,22.86 180 top
C9  14.92,19.68 90 top
C10  33.97,24.76 180 top
C11  33.97,28.57 180 top
C12  37.78,7.62 180 top
C13  37.78,9.84 180 top
C14  37.78,12.07 180 top
C15  33.97,18.42 180 top
C16  19.37,18.1 270 top
C19  10.48,39.37 180 top
C20  10.48,41.91 180 top
C22  14.61,24.76 180 top
C23  13.02,35.56 0 top
C24  13.34,14.29 0 top
D1  8.26,25.72 0 top
D2  27.62,44.77 0 top
D4  59.69,33.02 270 top
F2  6.03,33.66 0 top
IC2  16.19,31.43 270 top
JP1  63.5,43.81 90 top
JP3  0,0 0 top
JP4  1.91,40.64 0 top
JP5  50.8,43.81 90 top
JP6  38.1,43.81 90 top
JP7  60.96,43.81 90 top
JP8  48.26,43.81 90 top
JP9  35.56,43.81 90 top
JP10  58.42,43.81 90 top
JP11  45.72,43.81 90 top
JP12  33.02,43.81 90 top
JP13  55.88,43.81 90 top
JP14  43.18,43.81 90 top
JP15  30.48,43.81 90 top
JP16  53.34,43.81 90 top
JP17  40.64,43.81 90 top
JP18  52.07,10.16 270 top
JP19  -2.54,7.62 270 top
JP20  59.69,10.16 270 top
JP21  57.15,10.16 270 top
JP22  41.91,10.16 270 top
JP23  44.45,10.16 270 top
JP24  46.99,10.16 270 top
JP25  49.53,10.16 270 top
JP26  54.61,10.16 270 top
JP27  63.5,17.78 270 top
L1  19.94,11.37 0 top
L2  33.97,20.64 0 top
LED1  23.49,40.96 90 top
LED2  23.49,39.05 90 top
Q1  24.13,35.5 270 top
Q4  22.86,31.43 90 top
Q5  22.86,27.94 90 top
R1  27.3,39.05 180 top
R2  25.72,44.77 90 top
R3  34.29,9.52 90 top
R4  27.3,40.96 180 top
R5  63.18,36.83 90 top
R6  60.96,36.83 90 top
R7  26.99,15.88 270 top
R8  59.69,31.11 0 top
R9  37.15,23.18 90 top
R10  29.21,15.88 90 top
R11  33.97,26.67 180 top
R12  7.3,41.91 0 top
R13  7.3,39.37 0 top
R14  21.27,35.5 270 top
R15  27.3,35.88 180 top
R16  27.3,26.99 180 top
R17  14.61,26.67 180 top
R18  18.1,26.67 180 top
R20  27.3,30.48 180 top
S1  1.59,25.4 90 top
S2  20.3,2.49 0 top
U1  16.51,40.32 180 top
U2  6.35,16.51 90 top
U4  47.31,27.62 225 top
U$1  26.35,21.59 270 top
U$4  [OSHW-LOGO-M]  3.85,49.97 0 bottom
Y1  50.48,33.91 135 top

### Tracks (layer width: path | path; a pad name or v marks a point on that pad's centre or on a via)
3.3V  (via drill 0.5)
  Top 0.254: R14.1 21.9,36.4 22.23,36.07 23.13,36.07 Q1.1 23.49,36.44 23.49,45.34 22.86,45.97 18.67,45.97 | 20,35.81 16.57,35.81 15.56,36.83 | 14.61,9.84 14.86,9.59 14.86,6.98 15.24,6.6 18.92,6.6 20.64,4.89 20.64,4.45
  Top 0.305: C1.2 18.1,45.03 U1.3 18.1,45.4 18.67,45.97 18.73,46.04 22.86,46.04 23.49,45.4 | 14.92,35.88 U1.13 U1.14 15.56,36.83 | 14.92,35.88 14.92,34.92 15.56,34.29 15.56,32.39 15.24,32.07 IC2.2 | R14.1 20.59,36.4 20,35.81 | IC2.5 v16.83,29.53 | v15.88,35.24 15.56,35.24 14.92,35.88 | 11.11,16.19 12.44,14.87 C24.1 12.44,12.01 14.61,9.84 | 11.11,16.19 9.84,16.19 9.52,16.19 8.89,16.83 3.57,16.83 U2.4 | 11.11,16.19 11.11,22.22 v10.48,22.86 | v9.84,32.07 11.11,32.07 v11.43,32.39 | 23.22,36.13 Q1.1 | 20.64,4.45 20.64,2.54 22.23,0.95 24.45,0.95 v24.77,1.27
  Top 0.406: v28.89,4.45 v31.75,4.45 | U2.2 9.84,16.51 9.84,16.19
  Bottom 0.305: v16.83,29.53 16.83,33.02 | 16.83,33.02 16.83,34.29 v15.88,35.24 | v10.48,22.86 10.48,28.26 9.84,28.89 v9.84,32.07 | v11.43,32.39 16.19,32.39 16.83,33.02 | v24.77,1.27 24.77,2.22 26.99,4.45 v28.89,4.45 | JP3.3.3V 33.97,4.13 33.66,4.45 v31.75,4.45
5V  (via drill 0.5)
  Top 0.254: 27.3,34.61 27.3,32.7 | v22.54,43.5 22.54,43.18 v21.27,41.91 | U4.18 42.86,26.03 43.82,26.99 43.82,27.62 44.13,27.94 44.13,28.26 44.45,28.57 46.56,28.57 48.21,30.22 | 48.21,30.22 U4.6 | 48.21,30.22 48.9,29.53 49.85,29.53 50.63,30.31 U4.4 50.7,30.38 52.39,32.07 54.61,32.07 55.88,30.8 56.52,30.8 57.47,29.85 60.01,29.85 60.32,30.16 60.32,30.85 R8.2 61.91,31.11 63.18,32.39 65.41,32.39 66.04,31.75 66.04,30.57 JP3.VCC
  Top 0.305: JP3.VCC 67.04,30.43 67.63,29.85 67.63,18.42 65.99,16.78 JP27.3 65.77,16.78 66.04,16.51 66.04,11.11 62.55,7.62 62.55,5.71 61.6,4.76 40.32,4.76 JP3.5V | 27.62,28.89 Q5.2 23.18,28.89 22.86,29.21 22.86,31.43 23.81,32.38 Q4.2 | 27.62,28.89 28.26,29.53 28.26,30.43 R20.1 | 27.62,28.89 28.21,28.31 R16.1 28.21,26.3 26.99,25.08 26.99,24.76 v26.35,24.13 | Q4.2 23.96,32.87 23.49,33.34 IC2.8 17.78,33.34 15.88,31.43 12.12,31.43 | 27.3,34.61 28.21,35.51 R15.1 28.89,35.88 29.85,34.92 30.8,34.92 v31.12,35.24 | 27.3,32.7 26.99,32.39 Q4.2 | R4.1 R1.1 v29.21,39.05 | C23.1 12.12,31.43 | 12.12,31.43 12.12,29.9 8.89,26.67 8.89,19.38 U2.3
  Top 0.406: 38.1,10.79 38.63,10.26 C13.1 C12.1 38.63,6.45 40.32,4.76 | 38.1,10.79 35.56,10.79 35.24,10.48 34.34,10.48 R3.2 | C14.1 38.63,11.33 38.1,10.79
  Top 0.813: C13.1 40.32,9.84 40.64,10.16 JP22.2
  Bottom 0.254: JP15.2 22.86,43.81 v22.54,43.5 | v21.27,41.91 21.27,40.32 21.59,40 28.26,40 v29.21,39.05
  Bottom 0.305: v31.12,35.24 31.12,37.47 30.8,37.78 30.48,37.78 v29.21,39.05 | JP3.5V 38.1,2.22 36.83,0.95 32.07,0.95 JP3.IOREF 30.48,7.62 28.57,9.52 28.57,11.11 26.35,13.33 v26.35,24.13
  Bottom 0.813: JP22.2 JP23.2 JP24.2 JP25.2 JP18.2 JP26.2 JP21.2 JP20.2 | JP15.2 JP12.2 JP9.2 JP6.2 JP17.2 JP14.2 JP11.2 JP8.2 JP5.2 JP16.2 JP13.2 JP10.2 JP7.2 JP1.2
AD0  (via drill 0.5)
  Top 0.305: U4.23 41.91,19.4 JP22.1 43.18,11.43 43.18,6.35 43.82,5.71 v44.45,5.71
  Bottom 0.305: JP3.A0 49.21,2.54 46.35,5.4 44.77,5.4 v44.45,5.71
AD1  (via drill 0.5)
  Top 0.305: U4.24 44.45,20.81 JP23.1 45.72,11.43 45.72,6.35 46.35,5.71 v47.63,5.71
  Bottom 0.305: JP3.A1 52.71,2.54 51.43,3.81 49.21,3.81 47.63,5.4 v47.63,5.71
AD2  (via drill 0.5)
  Top 0.305: U4.25 49.53,21.44 49.53,20.64 46.99,18.1 JP24.1 48.26,11.43 48.26,6.67 v49.21,5.71
  Bottom 0.305: JP3.A2 55.56,2.54 53.98,4.13 52.07,4.13 50.48,5.71 v49.21,5.71
AD3  (via drill 0.5)
  Top 0.254: 50.48,20.32 50.42,20.26 50.42,14.48 49.53,13.59 JP25.1
  Top 0.305: 50.48,20.32 50.48,21.62 U4.26 | v51.75,5.71 50.8,6.67 50.8,11.43 JP25.1
  Bottom 0.305: JP3.A3 58.1,2.54 56.52,4.13 55.24,4.13 53.66,5.71 v51.75,5.71
AD4/SDA  (via drill 0.5)
  Top 0.305: 52.07,20 JP18.1 53.34,11.43 53.34,6.67 54.29,5.71 v54.61,5.71 | 52.07,20 52.07,21.16 U4.27 48.47,24.76 v47.94,24.76 | JP27.1 55.39,20.78 v55.24,20.64 | v53.02,20 52.07,20
  Bottom 0.305: v55.24,20.64 53.66,20.64 v53.02,20 | JP3.A4 60.64,2.54 59.05,4.13 57.47,4.13 55.88,5.71 v54.61,5.71 | JP3.SDA 21.34,43.75 22.54,42.55 27.3,42.55 31.75,38.1 31.75,35.88 32.07,35.56 32.07,33.34 36.2,29.21 36.2,27.62 38.74,25.08 47.63,25.08 v47.94,24.76
AD5/SCL  (via drill 0.5)
  Top 0.254: 29.21,41.28 28.89,41.59 28.89,41.91 27.94,42.86
  Top 0.305: 54.61,19.05 JP26.1 55.88,11.43 55.88,6.67 v56.83,5.71 | 54.61,19.05 54.61,19.75 U4.28 48.65,25.72 v48.26,25.72 | JP27.2 54.88,18.78 54.61,19.05 | v32.49,37.31 29.21,40.64 29.21,41.28 | 27.94,42.86 24.45,42.86 24.13,43.18 24.13,46.35 22.54,47.94 20,47.94 18.8,49.15 JP3.SCL
  Bottom 0.305: JP3.A5 63.18,2.54 61.6,4.13 60.01,4.13 58.42,5.71 v56.83,5.71 | v48.26,25.72 39.05,25.72 36.83,27.94 36.83,29.53 32.7,33.66 32.7,37.15 v32.49,37.31
AD6  (via drill 0.5)
  Top 0.305: v41.91,22.54 41.91,23.92 U4.19
  Bottom 0.305: JP21.1 57.15,13.97 55.88,15.24 49.21,15.24 v41.91,22.54
AD7  (via drill 0.5)
  Top 0.305: v43.5,22.22 43.61,22.22 U4.22
  Bottom 0.305: JP20.1 59.69,14.61 59.37,14.92 58.74,14.92 57.47,16.19 49.1,16.19 47.71,17.58 47.71,18.01 v43.5,22.22
AREF  (via drill 0.5)
  Top 0.305: C5.2 40.01,14.29 41.27,15.56 41.27,19.68 41.59,20 41.59,20.96 42.71,22.07 42.71,23.66 43.92,24.87 U4.20 43.99,24.94 44.77,25.72 v44.77,27.62 | JP3.AREF 25.46,52.39 42.86,52.39 43.82,51.44 43.82,48.58 44.45,47.94 44.45,38.1 45.09,37.47 49.85,37.47 v50.48,38.1
  Bottom 0.305: v50.48,38.1 44.77,32.39 v44.77,27.62
DTR
  Top 0.254: Q1.3 25.46,35.5 25.78,35.81 26.34,35.81 R15.2
  Top 0.305: C6.1 26.46,35.83 R15.2
GND  (via drill 0.5)
  Top 0.254: 55.88,30.16 v56.52,29.53 | U1.16 16.83,39.37 16.19,40 14.92,40 13.34,41.59 13.02,41.59 12.7,41.91 C20.1 | v25.4,18.42 26.99,18.42 27.3,18.73 | 27.3,18.73 v28.26,18.73 | 27.3,18.73 27.3,19.37 26.35,20.32 U$1.P$1 | 56.52,34.37 56.34,34.54 52.2,34.54 52.11,34.63 51.2,34.63 | C2.1 6.03,37.47 5.4,38.1 5.4,39.05 5.08,39.37 4.66,39.37 JP4.GND1
  Top 0.305: 51.08,29.81 U4.3 | U1.6 16.19,45.03 C1.1 | U2.1 9.45,13.73 v10.8,12.38 | v14.29,12.38 14.29,14.24 C24.2 14.23,14.87 14.92,15.56 C9.- | v35.88,26.67 36.2,26.67 37.15,25.72 R9.2 37.15,26.04 | v35.88,26.67 35.88,26.35 35.24,25.72 35.24,25.14 C10.1 | C15.1 34.87,17.41 | 34.87,17.41 32.38,14.92 v31.75,14.92 29.26,14.92 R10.1 29.21,12.56 C7.- | C11.1 34.93,28.57 35.88,27.62 v35.88,26.67 | 51.08,29.81 48.9,27.62 47.87,27.62 U4.21 44.62,24.3 45.72,25.4 45.72,25.08 47.31,23.5 47.31,19.37 46.35,18.42 46.35,17.78 v45.4,16.83 | 51.08,29.81 52.71,31.43 54.29,31.43 55.56,30.16 55.88,30.16 | D4.C 60.64,33.09 60.64,33.66 59.92,34.37 56.52,34.37 v56.52,32.07 56.52,32.7 | U4.5 50.06,31.01 50.8,31.75 51.12,31.75 | U$1.4 23.75,18.47 v23.8,18.56 | v30.16,18.73 30.8,18.73 v31.75,17.78 | 40.32,20.32 v40.64,20.32 39.69,20.32 39.69,17.78 v39.05,17.14 | v36.51,17.14 36.2,17.14 35.88,16.83 35.46,16.83 34.87,17.41 | C23.2 13.92,36.46 13.97,36.51 8.89,36.51 8.89,36.19 v9.21,36.19 | v6.98,36.19 6.35,35.56 6.35,28.26 6.67,27.94 7.3,27.94 7.94,27.31 7.94,20.96 v7.3,20.96 | 36.51,26.04 v35.88,26.67
  Bottom 0.254: v56.52,29.53 v56.52,32.07 | v23.8,18.56 25.26,18.56 v25.4,18.42 | v28.26,18.73 v30.16,18.73
  Bottom 0.305: v10.8,12.38 v14.29,12.38 | v31.75,17.78 v31.75,14.92 | v45.4,16.83 44.13,16.83 v40.64,20.32 | v39.05,17.14 v36.51,17.14 | v9.21,36.19 v6.98,36.19 | v7.3,20.96 v10.16,20.96
  pour Top: 0,53.34 0,-0.32 66.04,-0.32 66.04,2.86 66.36,2.86 68.58,5.08 68.58,38.1 66.04,40.64 66.04,52.07 64.77,53.34
  pour Bottom: 64.77,53.34 66.04,52.07 66.04,40.64 68.58,38.1 68.58,5.08 66.04,2.54 66.04,0 0,0 0,53.34
IO2/PIN2  (via drill 0.5)
  Top 0.305: v53.34,26.99 53.34,26.67 52.71,26.04 52.71,26.18 U4.32 | JP10.1 59.69,42.55 59.69,49.53 JP3.D2
  Bottom 0.305: JP10.1 58.1,41.28 54.93,38.1 54.93,28.57 v53.34,26.99
IO3/PIN3  (via drill 0.5)
  Top 0.305: v53.98,29.53 53.17,29.53 U4.1 | JP3.D3 57.15,49.53 57.15,42.55 JP13.1
  Bottom 0.305: JP13.1 55.88,40.96 53.98,39.05 v53.98,29.53
IO4/PIN4  (via drill 0.5)
  Top 0.305: U4.2 51.79,29.24 v53.02,30.48 | JP16.1 54.61,42.55 54.61,49.53 JP3.D4
  Bottom 0.305: v53.02,30.48 53.02,40.96 JP16.1
IO5/PIN5  (via drill 0.5)
  Top 0.254: 45.72,33.17 45.82,33.27 v45.82,34.53
  Top 0.305: U4.9 45.72,33.17 | JP5.1 50.8,41.59 52.07,42.86 52.07,49.53 JP3.D5
  Bottom 0.254: v45.82,34.53 49.87,38.57 49.87,39.16 50.71,40 50.8,40
  Bottom 0.305: 50.8,40 JP5.1
IO6/PIN6  (via drill 0.5)
  Top 0.305: U4.10 44.77,32.99 v44.77,35.24 | JP8.1 48.26,41.59 49.53,42.86 49.53,49.53 JP3.D6
  Bottom 0.305: v44.77,35.24 48.26,38.73 JP8.1
IO7/PIN7  (via drill 0.5)
  Top 0.305: U4.11 43.5,33.13 v43.5,35.24 | JP11.1 46.99,42.55 46.99,49.53 JP3.D7
  Bottom 0.305: v43.5,35.24 45.4,37.47 45.4,38.73 45.72,39.05 JP11.1
IO8/PIN8  (via drill 0.5)
  Top 0.305: U4.12 42.23,33.27 v42.23,35.24 | JP14.1 41.91,42.55 41.91,50.55 JP3.D8
  Bottom 0.305: v42.23,35.24 43.18,36.51 JP14.1
IO9/PIN9  (via drill 0.5)
  Top 0.305: U4.13 40.96,33.41 v40.96,35.24 | JP17.1 39.37,42.55 39.37,50.55 JP3.D9
  Bottom 0.305: v40.96,35.24 40.96,39.05 40.64,39.37 JP17.1
MISO/PIN12  (via drill 0.5)
  Top 0.254: v40.96,24.13 40.51,24.57 v40.51,27.5 | 56.52,28.26 56.39,28.13 v56.39,26.1
  Top 0.305: v36.51,35.24 36.51,34.46 U4.16 43.03,27.94 v43.18,27.94 | JP3.MISO 62.42,29.21 57.47,29.21 56.52,28.26 | JP12.1 31.75,42.55 31.75,50.55 JP3.D12
  Bottom 0.254: v40.51,27.5 40.96,27.94 v43.18,27.94 | v56.39,26.1 56.52,25.97 56.52,19.37
  Bottom 0.305: v36.51,35.24 33.02,39.05 JP12.1 | 56.52,19.37 55.88,18.73 49.21,18.73 43.82,24.13 v40.96,24.13
MOSI/PIN11  (via drill 0.5)
  Top 0.254: v43.18,18.92 42.86,18.61 v42.86,16.51 | v48.51,14.35 49.4,15.24 v49.4,17.21 | v59.05,26.04 60.96,26.04 61.6,26.67 64.96,26.67 JP3.MOSI
  Top 0.305: U4.15 38.1,34 v38.1,34.92 | JP9.1 34.29,42.55 34.29,50.55 JP3.D11 | v38.74,24.13 v38.74,29.85
  Bottom 0.254: 44.13,15.24 44.39,14.99 47.88,14.99 v48.51,14.35 | v49.4,17.21 49.66,17.46 56.83,17.46 58.42,19.05 58.42,25.4 v59.05,26.04
  Bottom 0.305: JP9.1 38.1,38.73 v38.1,34.92 38.1,30.48 v38.74,29.85 | v38.74,24.13 38.74,23.81 40.32,22.22 40.32,21.91 40.96,21.27 42.23,21.27 43.18,20.32 v43.18,18.92 | 44.13,15.24 v42.86,16.51
N$1
  Top 0.305: R2.1 27.6,43.87 D2.A
N$2
  Top 0.254: U1.17 17.46,39.37 19.05,40.96 LED1.C
N$3
  Top 0.305: D4.A 58.81,31.14 R8.1
N$4  (via drill 0.5)
  Top 0.254: LED2.C v18.73,39.05 | U1.10 13.65,41.91 14.8,40.77 v17.15,40.77
  Bottom 0.254: v17.15,40.77 17.15,40.64 v18.73,39.05
N$5
  Top 0.305: LED1.A R4.2
N$6
  Top 0.305: LED2.A R1.2
N$7
  Top 0.254: 49.21,32.39 49.34,32.51 50.04,32.51 50.21,32.34 50.61,32.34
  Top 0.305: 49.21,32.39 48.93,32.1 U4.7
N$8  (via drill 0.5)
  Top 0.254: 19.55,37.47 22.23,37.47 v22.35,37.34 | v25.08,37.34 28.38,37.34 28.88,36.84
  Top 0.305: 19.55,37.47 U1.20 | 28.88,36.84 28.88,36.7 29.7,35.88 30.16,35.88 30.48,36.19 31.43,36.19 31.75,35.88 34.29,35.88 34.61,36.19 51.12,36.19 52.07,35.24 62.49,35.24 R5.1
  Bottom 0.254: v22.35,37.34 v25.08,37.34
N$9  (via drill 0.5)
  Top 0.254: v18.01,41.44 18.01,41.68 17.58,42.11 17.58,42.89 U1.4
  Top 0.305: v29.85,36.83 31.43,36.83 31.75,36.51 34.29,36.51 34.61,36.83 51.43,36.83 52.39,35.88 60.91,35.88 R6.1
  Bottom 0.254: 19.68,40.32 19.68,40.64 19.37,40.96 18.5,40.96 v18.01,41.44
  Bottom 0.305: 19.68,40.32 19.68,39.05 20.32,38.1 28.57,38.1 v29.85,36.83
N$10
  Top 0.305: R9.1 36.46,22.28 36.2,22.54 35.19,22.54 C8.1
N$11
  Top 0.305: U$1.6 30.8,20.96 32.38,22.54 32.76,22.54 C8.2
N$12
  Top 0.254: 48.92,34.04 48.92,33.19 U4.8
N$13
  Top 0.254: C20.2 9.58,41.22 9.84,40.96 13.34,40.96 14.29,40 U1.12
  Top 0.305: R12.2 C20.2
N$14  (via drill 0.5)
  Top 0.305: Q1.2 23.19,34.86 22.23,34.86 21.96,34.6 R14.2 20.27,34.6 v20,34.86 | v19.37,44.39 U1.1
  Bottom 0.254: 19.37,37.47 19.37,35.5 v20,34.86
  Bottom 0.305: 19.37,37.47 16.19,40.64 16.19,43.81 16.76,44.39 v19.37,44.39
N$15
  Top 0.254: C19.2 9.58,40.06 9.84,40.32 13.02,40.32 13.65,39.69 U1.11
  Top 0.305: R13.2 C19.2
N$16
  Top 0.305: R7.1 R10.2 29.21,19.43 U$1.5
N$17  (via drill 0.5)
  Top 0.305: C16.1 19.37,20 v19.68,20.32 | v21.27,23.5 U$1.1
  Bottom 0.305: v19.68,20.32 19.68,21.91 v21.27,23.5
N$18
  Top 0.254: C16.2 19.43,17.13 | 18.73,11.37 L1.1
  Top 0.813: C16.2 20.37,17.2 21.59,18.42 21.59,20.32 22.23,20.96 U$1.3 | 19.43,17.13 19.43,12.07 18.73,11.37
N$19
  Top 0.254: L1.2 23.01,10.79
  Top 0.305: L2.1 C15.2 33.02,18.36 33.02,17.14 31.75,15.88 27.94,15.88 27.04,14.97 R7.2 | 25.86,10.48 C7.+
  Top 0.813: R7.2 26.18,14.16 C7.+ 23.01,10.79
N$20
  Top 0.305: U$1.8 28.95,24.51 32.38,27.94 32.38,28.57 C11.2
N$21
  Top 0.254: 31.69,25.09 31.24,24.64 31.24,24.51 31.26,24.5 31.26,22.97
  Top 0.305: U$1.7 30.48,22.22 31.26,22.97 | 31.69,25.09 32.32,25.72 33.92,25.72 R11.1
N$22
  Top 0.254: 1.23,22.9 0.64,23.5 0.64,24.38 0.95,24.7 0.95,24.76
  Top 0.305: JP19.PWR 11.16,7.89 7.62,11.43 3.18,11.43 1.59,13.02 1.59,22.9 1.23,22.9 | 0.95,24.76 3.22,24.76 S1.2
N$23
  Top 0.305: S1.1 4.1,23.15 5.4,24.45 5.4,25.01 D1.A
N$24
  Top 0.254: JP4.D-1 5.78,41.29 R12.1
N$25
  Top 0.305: R17.1 R18.2 | C22.1 R17.1 | R17.1 15.51,30.21 | 15.51,30.21 14.92,30.8 IC2.3 | IC2.6 16.09,30.8 15.51,30.21
N$26
  Top 0.305: R16.2 Q5.1 23.81,26.99 22.86,27.94 22.86,28.57 21.91,29.53 21.27,29.53 20.64,30.16 20.64,31.43 20,32.07 IC2.7
N$27  (via drill 0.5)
  Top 0.305: Q4.1 R20.2 26.35,30.53 v26.35,31.65 | IC2.1 13.59,34.23 v13.65,34.29
  Bottom 0.305: v13.65,34.29 11.75,34.29 10.62,33.66 10.62,29.53 11.75,28.26 20,28.26 21.59,29.85 24.13,29.85 26.04,31.75 v26.35,31.65
N$28
  Top 0.254: JP4.D+1 6.03,40.64 6.35,40.32 6.35,39.42 R13.1
N$29
  Top 0.254: JP4.VBUS1 5.43,41.94 5.72,42.23 5.72,42.86 | 3.49,34.15 1.73,34.15 0.64,35.24 0.64,42.23 0.95,42.55 2.54,42.55 2.86,42.86 2.86,43.18 3.49,43.81 C4.1
  Top 0.305: 5.72,42.86 5.72,43.5 6.03,43.81 C4.1 | 3.49,34.15 F2.1
RESET  (via drill 0.5)
  Top 0.254: JP3.RESET@2 55.83,25.35 54.29,23.81 | 51.68,23.81 52,23.5 54.29,23.5
  Top 0.305: 51.68,23.81 U4.29 | S2.2 25.08,2.54 26.67,0.95 31.43,0.95 JP3.RESET@1 34.29,3.81 R3.1 33.6,8.62 33.02,9.21 33.02,10.79 33.66,11.43 34.61,11.43 34.93,11.75 34.93,14.92 35.88,15.88 37.15,15.88 38.1,16.83 38.1,27.94 v37.78,28.26 37.78,28.57 36.51,29.85 31.96,29.85 C6.2 | v53.34,22.22 54.29,23.18 54.29,23.5 54.29,23.81
  Bottom 0.305: v53.34,22.22 48.9,26.67 40.01,26.67 38.42,28.26 v37.78,28.26
RX  (via drill 0.5)
  Top 0.305: JP3.D0 64.77,49.53 64.77,42.55 JP1.1 63.5,39.95 63.18,39.64 R5.2 62.87,37.41 62.87,37.15 62.55,36.83 59.69,36.83 58.42,38.1 57.47,38.1 57.15,37.78 v57.15,36.83 | v52.71,24.45 52.18,24.45 U4.30
  Bottom 0.254: 53.66,24.45 57.15,27.94 57.15,28.45 57.4,28.7 57.4,32.77 57.15,33.02 v57.15,36.83
  Bottom 0.305: 53.66,24.45 v52.71,24.45
SCK/PIN13  (via drill 0.5)
  Top 0.254: 39.69,24.45 39.37,24.76 39.37,28.89
  Top 0.305: JP3.SCK 57.74,27.89 57.47,27.62 v57.47,26.16 | U4.17 42.29,27.24 40.01,29.53 | 40.01,29.53 v35.24,34.29 | JP15.1 30.16,41.28 28.89,42.55 28.89,48.26 | 28.89,48.26 28.89,50.74 JP3.D13 | R2.2 25.72,46.04 27.62,47.94 28.57,47.94 28.89,48.26 | 39.37,28.89 40.01,29.53 | 39.69,24.45 39.69,23.81 v40.32,23.18
  Bottom 0.305: v35.24,34.29 35.24,35.56 31.43,39.37 31.43,40.32 JP15.1 | v57.47,26.16 57.47,19.37 56.2,18.1 48.9,18.1 43.5,23.5 41.59,23.5 41.27,23.18 v40.32,23.18
SS/PIN10  (via drill 0.5)
  Top 0.305: U4.14 39.37,33.86 v39.37,35.24 | JP6.1 36.83,42.55 36.83,50.55 JP3.D10
  Bottom 0.305: v39.37,35.24 39.37,39.05 38.1,40.32 JP6.1
TX  (via drill 0.5)
  Top 0.305: JP3.D1 62.23,49.53 62.23,42.55 JP7.1 60.96,38.73 | v55.88,36.83 55.88,38.1 56.78,39 60.7,39 60.96,38.73 | v53.34,25.4 52.36,25.4 U4.31 | R6.2 60.96,38.73
  Bottom 0.254: v53.34,25.4 55.88,27.94 55.88,28.57 55.63,28.83 55.63,32.64 55.88,32.89 v55.88,36.83
USB_5V  (via drill 0.5)
  Top 0.254: 21.76,31.9 21.76,32.11 v21.28,32.59
  Top 0.305: C3.A 7.75,31.25 8.26,31.75 8.26,33.48 F2.2 8.2,33.78 C2.2 11.43,37.47 v11.81,37.85 | v15.88,39.05 16.19,38.73 U1.15 | Q4.3 21.76,31.9
  Bottom 0.305: v11.81,37.85 13.02,39.05 v15.88,39.05 18.41,36.51 18.41,34.29 18.73,33.97 20.32,33.97 21.27,33.02 v21.28,32.59
VDD5  (via drill 0.5)
  Top 0.254: v22.1,17.4 22.35,17.65 26.67,17.65 26.87,17.86 v27.47,17.86 | v31.37,20.07 31.75,20.45 31.75,21.08 32.26,21.59 32.38,21.59
  Top 0.305: L2.2 34.87,20.69 33.97,21.59 32.38,21.59 | v20.64,27.31 21.13,27.31 Q5.3
  Bottom 0.254: 19.37,17.78 21.72,17.78 v22.1,17.4 | v27.47,17.86 27.55,17.78 30.48,17.78 31.37,18.67 v31.37,20.07
  Bottom 0.305: 19.37,17.78 18.41,18.73 18.41,25.08 v20.64,27.31
VIN  (via drill 0.5)
  Top 0.254: 32.38,24.45 32.38,24.19 v32,23.81
  Top 0.305: v20.96,24.76 19.05,24.76 | R11.2 32.38,26.67 v31.41,25.81 | v36.2,25.4 36.2,24.45 35.56,23.81 34.02,23.81 C10.2 32.7,24.76 32.38,24.45
  Top 0.813: 19.05,25.08 16.05,22.08 C9.+ 12.84,22.08 11.43,23.5 11.43,25.4 11.11,25.72 D1.C | 19.05,25.08 19.05,26.62 R18.1 | 19.05,25.08 19.05,24.76 19.05,23.81 20.64,22.22 U$1.2
  Bottom 0.254: 31.12,24.76 32,23.88 v32,23.81
  Bottom 0.305: v31.41,25.81 21.91,25.72 v20.96,24.76 22.23,24.76 22.54,25.08 26.99,25.08 27.3,24.76 31.12,24.76 | v36.2,25.4 39.69,21.91 39.69,18.42 40.01,18.1 40.01,6.35 42.55,3.81 44.77,3.81 45.72,2.86 JP3.VIN

### Text on the board
Top: V1.0
tNames: D13 | TX | . | . | . | . | . | . | TX | RX | 13 | 12 | 11 | 10 | 9 | 8 | 7 | 6 | 5 | 4 | 3 | 2 | 1 | 0 | RX | POWER | SDA | SCL | 5V | A0 | A1 | A2 | A3 | A4 | A5 | A6 | A7 | GND
bNames: ON - OFF | DC 7-23V